# EAGLE design coringaM0 (EAGLE 7.5.0)
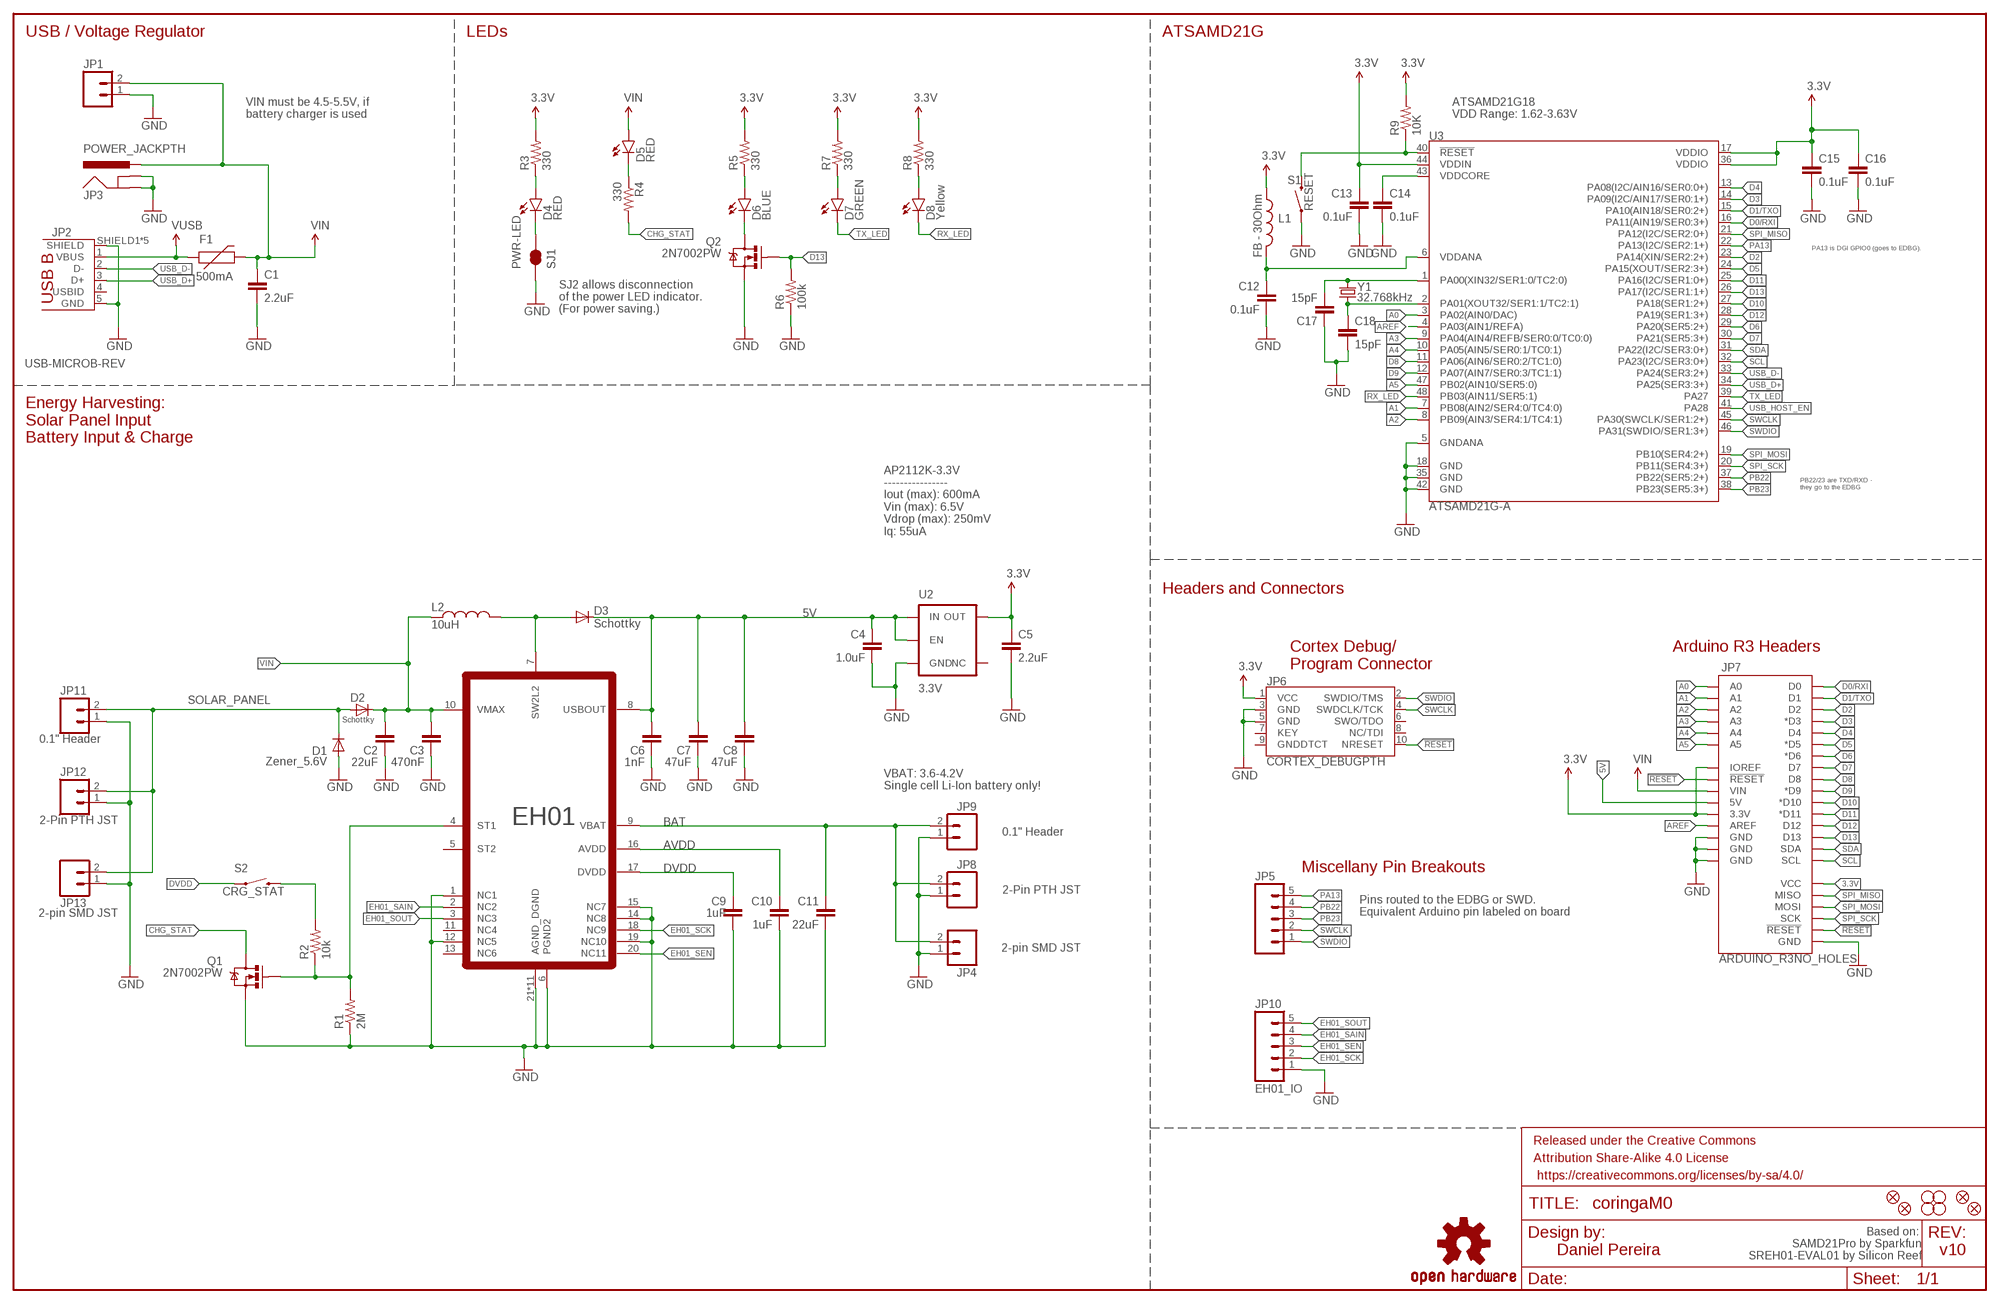
[diagram p0: schematic, sheet 1]

## Parts
C1  2.2uF  CAP1206  [1206]
C2  22uF  CAPC0805  [RCL_C0805]
C3  470nF  CAPC1206  [RCL_C1206]
C4  1.0uF  1.0UF-25V-+80/-20(0805)"  [0805-CAP]
C5  2.2uF  CAP1206  [1206]
C6  1nF  CAPC1206K  [RCL_C1206K]
C7  47uF  CAPC1206K  [RCL_C1206K]
C8  47uF  CAPC1206K  [RCL_C1206K]
C9  1uF  CAPC0402  [RCL_C0402]
C10  1uF  CAPC0402  [RCL_C0402]
C11  22uF  CAPC0805  [RCL_C0805]
C12  0.1uF  0.1UF-25V(+80/-20%)(0603)  [0603-CAP]
C13  0.1uF  0.1UF-25V(+80/-20%)(0603)  [0603-CAP]
C14  0.1uF  0.1UF-25V(+80/-20%)(0603)  [0603-CAP]
C15  0.1uF  0.1UF-25V(+80/-20%)(0603)  [0603-CAP]
C16  0.1uF  0.1UF-25V(+80/-20%)(0603)  [0603-CAP]
C17  15pF  15PF-50V-5%(0603)  [0603-CAP]
C18  15pF  15PF-50V-5%(0603)  [0603-CAP]
D1  Zener_5.6V  DIODE-DO-214AC  [DO-214AC]
D2  Schottky  DIODE-DO-214AC  [DO-214AC]
D3  Schottky  DIODE-DO-214AC  [DO-214AC]
D4  RED  LED-RED0603  [LED-0603]
D5  RED  LED-RED0603  [LED-0603]
D6  BLUE  LED-BLUE0603  [LED-0603]
D7  GREEN  LED-GREEN0603  [LED-0603]
D8  Yellow  LED-YELLOW0603  [LED-0603]
F1  500mA  PTCSMD  [PTC-1206]
FD1  FIDUCIAL-VIA  [FIDUCIAL-VIA]
FD2  FIDUCIAL-VIA  [FIDUCIAL-VIA]
FID1  FIDUCIAL1X2  [FIDUCIAL-1X2]
FID2  FIDUCIAL1X2  [FIDUCIAL-1X2]
FRAME1  FRAME-LEDGER  [CREATIVE_COMMONS]
JP1  M02PTH  [1X02]
JP2  USB-MICROB-REV  [USB-B-MICRO-REV-SMD]
JP3  POWER_JACKPTH  [POWER_JACK_PTH]
JP4  M02-JST-2MM-SMT  [JST-2-SMD]
JP5  M05NO_SILK  [1X05_NO_SILK]
JP6  CORTEX_DEBUGPTH  [2X5-PTH-1.27MM]
JP7  ARDUINO_R3NO_HOLES  [ARDUINO_R3_NO_HOLES]
JP8  M02-JST-2-PTH-NO_SILK  [JST-2-PTH-NS]
JP9  M021X02_NO_SILK  [1X02_NO_SILK]
JP10  EH01_IO  M05NO_SILK  [1X05_NO_SILK]
JP11  M021X02_NO_SILK  [1X02_NO_SILK]
JP12  M02-JST-2-PTH-NO_SILK  [JST-2-PTH-NS]
JP13  M02-JST-2MM-SMT  [JST-2-SMD]
L1  FB - 30Ohm  INDUCTOR0603  [0603]
L2  10uH  INDUCTOR-SRN4065  [SRN4065-100M]
LOGO3  OSHW-LOGOS  [OSHW-LOGO-S]
LOGO4  OSHW-LOGOL  [OSHW-LOGO-L]
Q1  2N7002PW  MOSFET-NCHANNEL2N7002PW  [SOT323]
Q2  2N7002PW  MOSFET-NCHANNEL2N7002PW  [SOT323]
R1  2M  RESR0402  [RESISTOR_R0402]
R2  10k  RESR0402  [RESISTOR_R0402]
R3  330  330OHM1/10W1%(0603)  [0603-RES]
R4  330  330OHM1/10W1%(0603)  [0603-RES]
R5  330  330OHM1/10W1%(0603)  [0603-RES]
R6  100k  100KOHM-1/10W-1%(0603)  [0603-RES]
R7  330  330OHM1/10W1%(0603)  [0603-RES]
R8  330  330OHM1/10W1%(0603)  [0603-RES]
R9  10K  10KOHM-1/10W-1%(0603)0603  [0603-RES]
S1  RESET  SWITCH-MOMENTARY-2SMD  [TACTILE-SWITCH-SMD]
S2  CRG_STAT  SWITCH-MOMENTARY-2SMD  [TACTILE-SWITCH-SMD]
SJ1  PWR-LED  JUMPER-PAD-2-NC_BY_TRACENO_SILK  [PAD-JUMPER-2-NC_BY_TRACE_NO_SILK]
STANDOFF1  STAND-OFF  [STAND-OFF]
STANDOFF2  STAND-OFF  [STAND-OFF]
STANDOFF3  STAND-OFF  [STAND-OFF]
STANDOFF4  STAND-OFF  [STAND-OFF]
U1  EH01  EH01-P02  [QFN20]
U2  3.3V  V_REG_AP2112K-3.3V  [SOT23-5]
U3  ATSAMD21G-A  [TQFP-48]
Y1  32.768kHz  CRYSTAL3.2X1.5MM  [CRYSTAL-SMD-3.2X1.5MM]

## Nets
3.3V: C5.1 C13.1 C15.1 C16.1 JP6.1(VCC) JP7.3.3V JP7.IOREF JP7.VCC L1.1 R3.2 R5.2 R7.2 R8.2 R9.2 U2.5(OUT) U3.17(VDDIO) U3.36(VDDIO) U3.44(VDDIN)
5V: C4.1 C6.2 C7.2 C8.2 D3.C JP7.5V U1.8(USBOUT) U2.1(IN) U2.3(EN)
!RESET: JP6.10(NRESET) JP7.RESET@1(!RESET!) JP7.RESET@2(!RESET!) R9.1 S1.3 U3.40(!RESET!)
A0: JP7.A0 U3.3(PA02(AIN0/DAC))
A1: JP7.A1 U3.7(PB08(AIN2/SER4:0/TC4:0))
A2: JP7.A2 U3.8(PB09(AIN3/SER4:1/TC4:1))
A3: JP7.A3 U3.9(PA04(AIN4/REFB/SER0:0/TC0:0))
A4: JP7.A4 U3.10(PA05(AIN5/SER0:1/TC0:1))
A5: JP7.A5 U3.47(PB02(AIN10/SER5:0))
AREF: JP7.AREF U3.4(PA03(AIN1/REFA))
AVDD: C10.2 U1.16(AVDD)
BAT: C11.2 JP4.2 JP8.2 JP9.2 U1.9(VBAT)
CHG_STAT: Q1.3(D) R4.2
D0/RXI: JP7.D0 U3.16(PA11(AIN19/SER0:3+))
D1/TXO: JP7.D1 U3.15(PA10(AIN18/SER0:2+))
D2: JP7.D2 U3.23(PA14(XIN/SER2:2+))
D3: JP7.D3(*D3) U3.14(PA09(I2C/AIN17/SER0:1+))
D4: JP7.D4 U3.13(PA08(I2C/AIN16/SER0:0+))
D5: JP7.D5(*D5) U3.24(PA15(XOUT/SER2:3+))
D6: JP7.D6(*D6) U3.29(PA20(SER5:2+))
D7: JP7.D7 U3.30(PA21(SER5:3+))
D8: JP7.D8 U3.11(PA06(AIN6/SER0:2/TC1:0))
D9: JP7.D9(*D9) U3.12(PA07(AIN7/SER0:3/TC1:1))
D10: JP7.D10(*D10) U3.27(PA18(SER1:2+))
D11: JP7.D11(*D11) U3.25(PA16(I2C/SER1:0+))
D12: JP7.D12 U3.28(PA19(SER1:3+))
D13: JP7.D13 Q2.1(G) R6.2 U3.26(PA17(I2C/SER1:1+))
DVDD: C9.2 S2.1 U1.17(DVDD)
EH01_SAIN: JP10.4 U1.2(NC2)
EH01_SCK: JP10.2 U1.18(NC9)
EH01_SEN: JP10.3 U1.20(NC11)
EH01_SOUT: JP10.5 U1.3(NC3)
EH01_ST1: Q1.1(G) R1.2 R2.1 U1.4(ST1)
EH01_SW: D3.A L2.P$2 U1.7(SW2L2)
GND: C1.2 C2.1 C3.1 C4.2 C5.2 C6.1 C7.1 C8.1 C9.1 C10.1 C11.1 C12.2 C13.2 C14.2 C15.2 C16.2 C17.1 C18.2 D1.A JP1.1 JP2.5(GND) JP2.SHIELD1(SHIELD) JP2.SHIELD2(SHIELD) JP2.SHIELD3(SHIELD) JP2.SHIELD4(SHIELD) JP2.SHIELD5(SHIELD) JP3.GND JP3.GNDBREAK JP4.1 JP6.3(GND) JP6.5(GND) JP7.GND@1(GND) JP7.GND@2(GND) JP7.GND@3(GND) JP7.GND@4(GND) JP8.1 JP9.1 JP10.1 JP11.1 JP12.1 JP13.1 Q1.2(S) Q2.2(S) R1.1 R6.1 S1.1 SJ1.1 U1.1(NC1) U1.6(PGND2) U1.12(NC5) U1.14(NC8) U1.15(NC7) U1.19(NC10) U1.21(AGND_DGND) U1.22(AGND_DGND) U1.P$1(AGND_DGND) U1.P$2(AGND_DGND) U1.P$3(AGND_DGND) U1.P$4(AGND_DGND) U1.P$5(AGND_DGND) U1.P$6(AGND_DGND) U1.P$7(AGND_DGND) U1.P$8(AGND_DGND) U1.P$9(AGND_DGND) U2.2(GND) U3.5(GNDANA) U3.18(GND) U3.35(GND) U3.42(GND)
N$2: C17.2 U3.1(PA00(XIN32/SER1:0/TC2:0)) Y1.P$2
N$3: D6.C Q2.3(D)
N$4: C18.1 U3.2(PA01(XOUT32/SER1:1/TC2:1)) Y1.P$1
N$5: D4.A R3.1
N$6: D6.A R5.1
N$8: D5.C R4.1
N$10: D7.A R7.1
N$11: D8.A R8.1
N$12: D4.C SJ1.2
N$14: R2.2 S2.3
PA13: JP5.5 U3.22(PA13(I2C/SER2:1+))
PB22: JP5.4 U3.37(PB22(SER5:2+))
PB23: JP5.3 U3.38(PB23(SER5:3+))
RX_LED: D8.C U3.48(PB03(AIN11/SER5:1))
SCL: JP7.SCL U3.32(PA23(I2C/SER3:0+))
SDA: JP7.SDA U3.31(PA22(I2C/SER3:0+))
SOLAR_PANEL: D1.C D2.A JP11.2 JP12.2 JP13.2
SPI_MISO: JP7.MISO U3.21(PA12(I2C/SER2:0+))
SPI_MOSI: JP7.MOSI U3.19(PB10(SER4:2+))
SPI_SCK: JP7.SCK U3.20(PB11(SER4:3+))
SWCLK: JP5.2 JP6.4(SWDCLK/TCK) U3.45(PA30(SWCLK/SER1:2+))
SWDIO: JP5.1 JP6.2(SWDIO/TMS) U3.46(PA31(SWDIO/SER1:3+))
TX_LED: D7.C U3.39(PA27)
USB_D+: JP2.3(D+) U3.34(PA25(SER3:3+))
USB_D-: JP2.2(D-) U3.33(PA24(SER3:2+))
USB_HOST_EN: U3.41(PA28)
VDDANA: C12.1 L1.2 U3.6(VDDANA)
VDDCORE: C14.1 U3.43(VDDCORE)
VIN: C1.1 C2.2 C3.2 D2.C D5.A F1.2 JP1.2 JP3.PWR JP7.VIN L2.P$1 U1.10(VMAX)
VUSB: F1.1 JP2.1(VBUS)
Unconnected: JP2.4(USBID) JP6.6(SWO/TDO) JP6.7(KEY) JP6.8(NC/TDI) JP6.9(GNDDTCT) U1.5(ST2) U1.11(NC4) U1.13(NC6) U2.4(NC)

## Notes on the sheet
- USB / Voltage Regulator | LEDs | ATSAMD21G
- VIN must be 4.5-5.5V, if 
  battery charger is used
- ATSAMD21G18
  VDD Range: 1.62-3.63V
- PA13 is DGI GPIO0 (goes to EDBG).
- SJ2 allows disconnection
  of the power LED indicator.
  (For power saving.)
- Energy Harvesting:
  Solar Panel Input
  Battery Input & Charge
- AP2112K-3.3V
  ----------------
  Iout (max): 600mA 
  Vin (max): 6.5V
  Vdrop (max): 250mV
  Iq: 55uA
- PB22/23 are TXD/RXD - 
  they go to the EDBG
- Headers and Connectors
- Cortex Debug/
  Program Connector
- Arduino R3 Headers
- 0.1" Header
- VBAT: 3.6-4.2V
  Single cell Li-Ion battery only\!
- 2-Pin PTH JST
- 0.1" Header
- Miscellany Pin Breakouts
- 2-Pin PTH JST
- Pins routed to the EDBG or SWD.
  Equivalent Arduino pin labeled on board
- 2-pin SMD JST
- 2-pin SMD JST
- Based on: 
  SAMD21Pro by Sparkfun
  SREH01-EVAL01 by Silicon Reef
- Daniel Pereira | v10

## Library data of the parts
C1 C5 = SparkFun-Passives:CAP: Capacitor Standard 0603 ceramic capacitor, and 0.1" leaded capacitor.
C2 C3 C6-C11 = Reference_design:CAP: CAPACITOR, European symbol
C4 = SparkFun-Capacitors:1.0UF-25V-+80/-20(0805): CAP-11625; PROD_ID: CAP-11625
C12-C16 = SparkFun-Capacitors:0.1UF-25V(+80/-20%)(0603): CAP-00810 Ceramic Standard decoupling cap; PROD_ID: CAP-00810
C17 C18 = SparkFun-Capacitors:15PF-50V-5%(0603): CAP-07881; PROD_ID: CAP-07881
D1-D3 = diode:DIODE-: DIODE
D4 D5 = SparkFun-LED:LED-RED: Assorted Red LEDs LilyPad 1206- DIO-09912 1206- DIO-00809 0603- DIO-00819 "SMART" means more efficient and expensive; PROD_ID: DIO-00819
D6 = SparkFun-LED:LED-BLUE: Blue LEDs for production use Various blue LEDs stocked by SparkFun production 0603 - DIO-08575 Rebel - DIO-09553 1206 - DIO-09911; PROD_ID: DIO-08575
D7 = SparkFun-LED:LED-GREEN: Various green LEDs Green LEDs used in SFE Production 0603- DIO-00821 LARGE- DIO-00862 LILYPAD- DIO-09910; PROD_ID: DIO-00821
D8 = SparkFun-LED:LED-YELLOW: Yellow SMD LEDs LilyPad 1206- DIO-09909 0603- DIO-09003 "SMART" means more efficient and expensive; PROD_ID: DIO-09003
F1 = SparkFun-PowerIC:PTC: Resettable Fuse PTC Resettable Fuse. Spark Fun Electronics SKU : COM-08357; PROD_ID: RES-11150
FD1 FD2 = SparkFun-Aesthetics:FIDUCIAL-VIA: Fiducial Alignment Points Various fiducial points for machine vision alignment.
FID1 FID2 = SparkFun-Aesthetics:FIDUCIAL: Fiducial Alignment Points Various fiducial points for machine vision alignment.
FRAME1 = SparkFun-Aesthetics:FRAME-LEDGER: Schematic Frame Standard 11x14 US Ledger frame
JP1 JP8 JP9 JP11 JP12 = SparkFun-Connectors:M02: Standard 2-pin 0.1" header. Use with - straight break away headers ( PRT-00116) - right angle break away headers (PRT-00553) - swiss pins (PRT-00743) - machine pins (PRT-00117) - female headers (PRT-00115) Molex polarized connector foot print use with: PRT-08233 with associated crimp pins and housings. 2.54_SCREWTERM for use with PRT-10571. 3.5mm Screw Terminal footprints for PRT-08084 5mm Screw Terminal footprints for use with PRT-08432
JP2 = coringaM0-Lib:USB-MICROB-REV; MPN: ZX62R-B-5P
JP3 = SparkFun-Connectors:POWER_JACK: Power Jack This is the standard 5.5mm barrel jack for power. The PTH is the most common, proven, reliable, footprint. The Slot footprint only works if the mill layer is transmitted to the PCB fab house so be warned. Mating wall wart : TOL-00298 (and others); PROD_ID: CONN-08197
JP4 JP13 = SparkFun-Connectors:M02: Standard 2-pin 0.1" header. Use with - straight break away headers ( PRT-00116) - right angle break away headers (PRT-00553) - swiss pins (PRT-00743) - machine pins (PRT-00117) - female headers (PRT-00115) Molex polarized connector foot print use with: PRT-08233 with associated crimp pins and housings. 2.54_SCREWTERM for use with PRT-10571. 3.5mm Screw Terminal footprints for PRT-08084 5mm Screw Terminal footprints for use with PRT-08432; PROD_ID: CONN-11443
JP5 JP10 = SparkFun-Connectors:M05: Header 5 Standard 5-pin 0.1" header. Use with straight break away headers (SKU : PRT-00116), right angle break away headers (PRT-00553), swiss pins (PRT-00743), machine pins (PRT-00117), and female headers (PRT-00115). Molex polarized connector foot print use with SKU : PRT-08230 with associated crimp pins and housings.
JP6 = samd21-temp:CORTEX_DEBUG: Cortex Debug Connector Datasheet <http://infocenter.arm.com/help/topic/com.arm.doc.faqs/attached/13634/cortex_debug_connectors.pdf>
JP7 = SparkFun-Boards:ARDUINO_R3: Arduino R3 Footprint (w/ SPI header)
L1 = SparkFun-Passives:INDUCTOR: Inductors Basic Inductor/Choke - 0603 and 1206. Footprints are not proven and vary greatly between part numbers. INDUCTOR POWER 3.3UH 4.0A SMD 0.197" L x 0.197" W x 0.177" H (5.00mm x 5.00mm x 4.50mm); PROD_ID: RES-07859
L2 = siliconreef:INDUCTOR
LOGO3 LOGO4 = SparkFun-Aesthetics:OSHW-LOGO: Open Source Hardware Logo This logo indicates the piece of hardware it is found on incorporates a OSHW license and/or adheres to the definition of open source hardware found here: http://freedomdefined.org/OSHW
Q1 Q2 = SparkFun-DiscreteSemi:MOSFET-NCHANNEL: Common NMOSFET Parts MFG P/N Store ID Prod ID FDD8780 TRANS-09984 SI7820DN TRANS-11055 FDS6630A IC-08089 2N7002PW TRANS-11151 FQP30N06L COM-10213 TRANS-10060 BSS123LT1G TRANS-08345 BSS138 TRANS-00830 BS170 2N7000; PROD_ID: TRANS-11151
R1 R2 = Reference_design:RES: RESISTOR, American symbol
R3-R5 R7 R8 = SparkFun-Resistors:330OHM1/10W1%(0603): RES-00818; PROD_ID: RES-00818
R6 = SparkFun-Resistors:100KOHM-1/10W-1%(0603): RES-07828; PROD_ID: RES-07828
R9 = SparkFun-Resistors:10KOHM-1/10W-1%(0603): RES-00824; PROD_ID: RES-00824
S1 S2 = SparkFun-Electromechanical:SWITCH-MOMENTARY-2: Various NO switches- pushbuttons, reed, etc; PROD_ID: SWCH-08247
SJ1 = SparkFun-Passives:JUMPER-PAD-2-NC_BY_TRACE
STANDOFF1-STANDOFF4 = SparkFun-Electromechanical:STAND-OFF: #4 Stand Off This is the mechanical footprint for a #4 phillips button head screw. Use the keepout ring to avoid running the screw head into surrounding components. SKU : PRT-00447
U1 = reference-design:EH01: EH01 uses 0.18um CMOS technology and is available at PQFN20 package (5mm x 5mm), compatible with MO-220 VHHC-2 JEDEC standard.
U2 = SparkFun-PowerIC:V_REG_AP2112: AP2112 - 600mA CMOS LDO Regulator w/ Enable The AP2112 is CMOS process low dropout linear regulator with enable function, the regulator delivers a guaranteed 600mA (min.) continuous load current. Features Output Voltage Accuracy: ±1.5% Output Current: 600mA (Min.) Foldback Short Current Protection: 50mA Enable Function to Turn ON/OFF VOUT Low Dropout Voltage (3.3V): 250mV (Typ.) @IOUT=600mA Excellent Load Regulation: 0.2%/A (Typ.) Excellent Line Regulation: 0.02%/V (Typ.) Low Quiescent Current: 55μA (Typ.) Low Standby Current: 0.01μA (Typ.) Low Output Noise: 50μVRMS PSRR: 100Hz -65dB, 1kHz -65dB OTSD Protection Stable with 1.0μF Flexible Cap: Ceramic, Tantalum and Aluminum Electrolytic Operation Temperature Range: -40°C to 85°C ESD: MM 400V, HBM 4000V; PROD_ID: VREG-12457
U3 = samd21-temp:ATSAMD21G: Atmel SAMD21G SMART ARM-Based Microcontroller The Atmel ® | SMART ™ SAM D21 is a series of low-power microcontrollers using the 32-bit ARM ® Cortex ® -M0+ processor, and ranging from 32- to 64-pins with up to 256KB Flash and 32KB of SRAM. The SAM D21 devices operate at a maximum frequency of 48MHz and reach 2.46 CoreMark/MHz. They are designed for simple and intuitive migration with identical peripheral modules, hex compatible code, identical linear address map and pin compatible migration paths between all devices in the product series. All devices include intelligent and flexible peripherals, Atmel Event System for inter-peripheral signaling, and support for capacitive touch button, slider and wheel user interfaces.; PROD_ID: IC-13064
Y1 = samd21-temp:CRYSTAL: Various standard crystals. Proven footprints.; PROD_ID: XTAL-13062

## Board
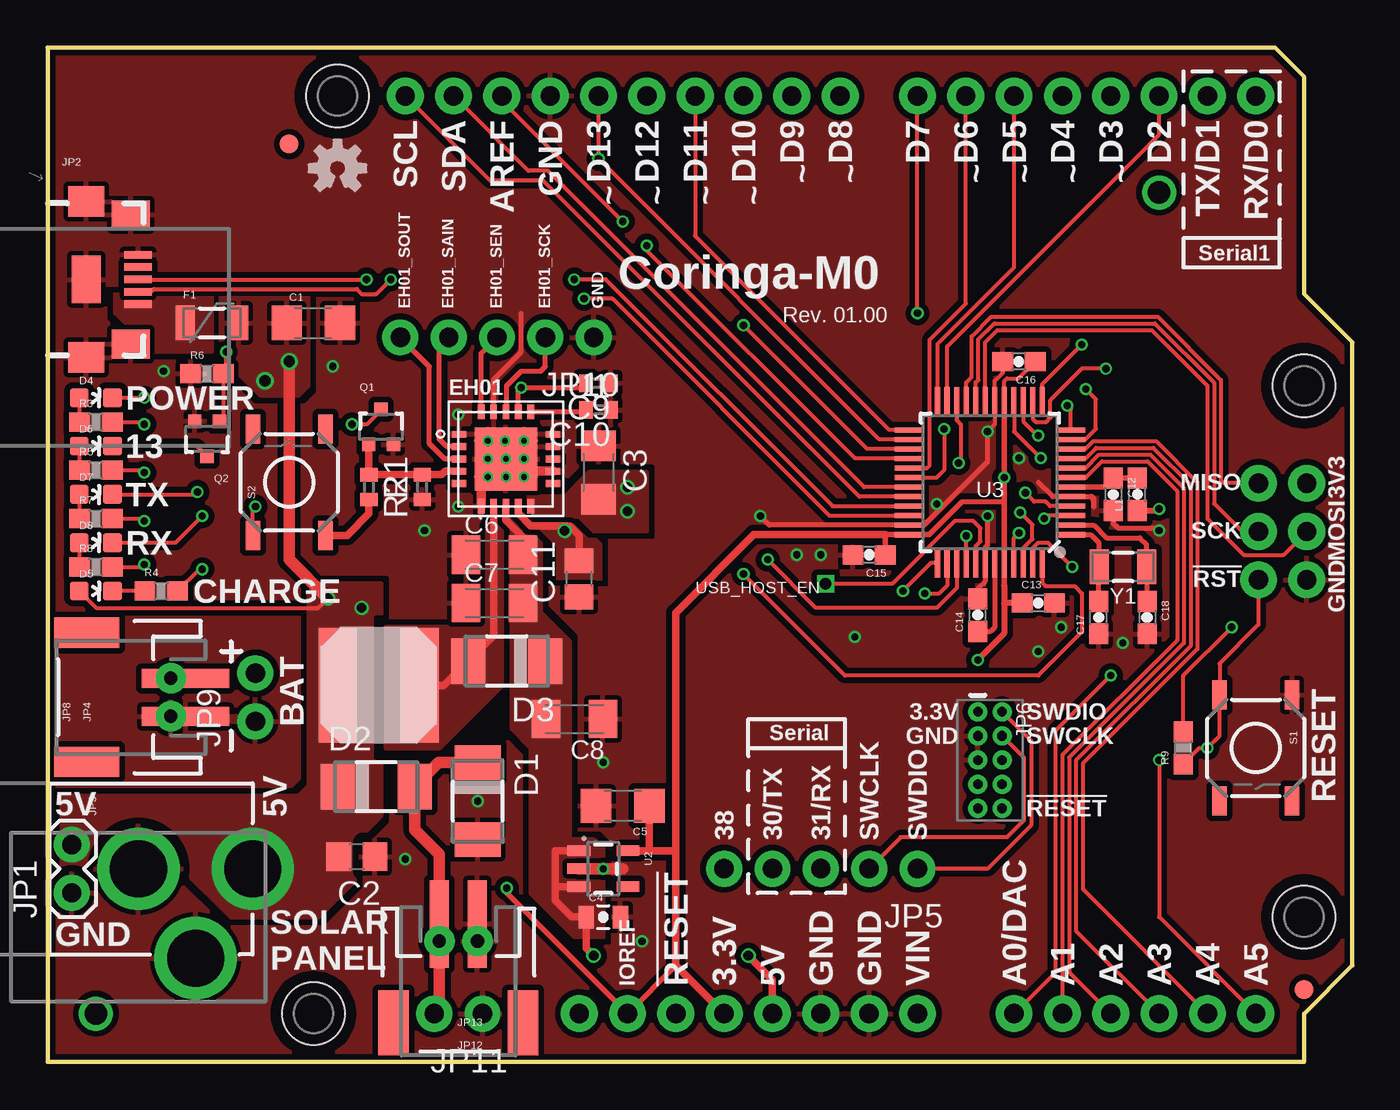
[diagram p1: board, top side]
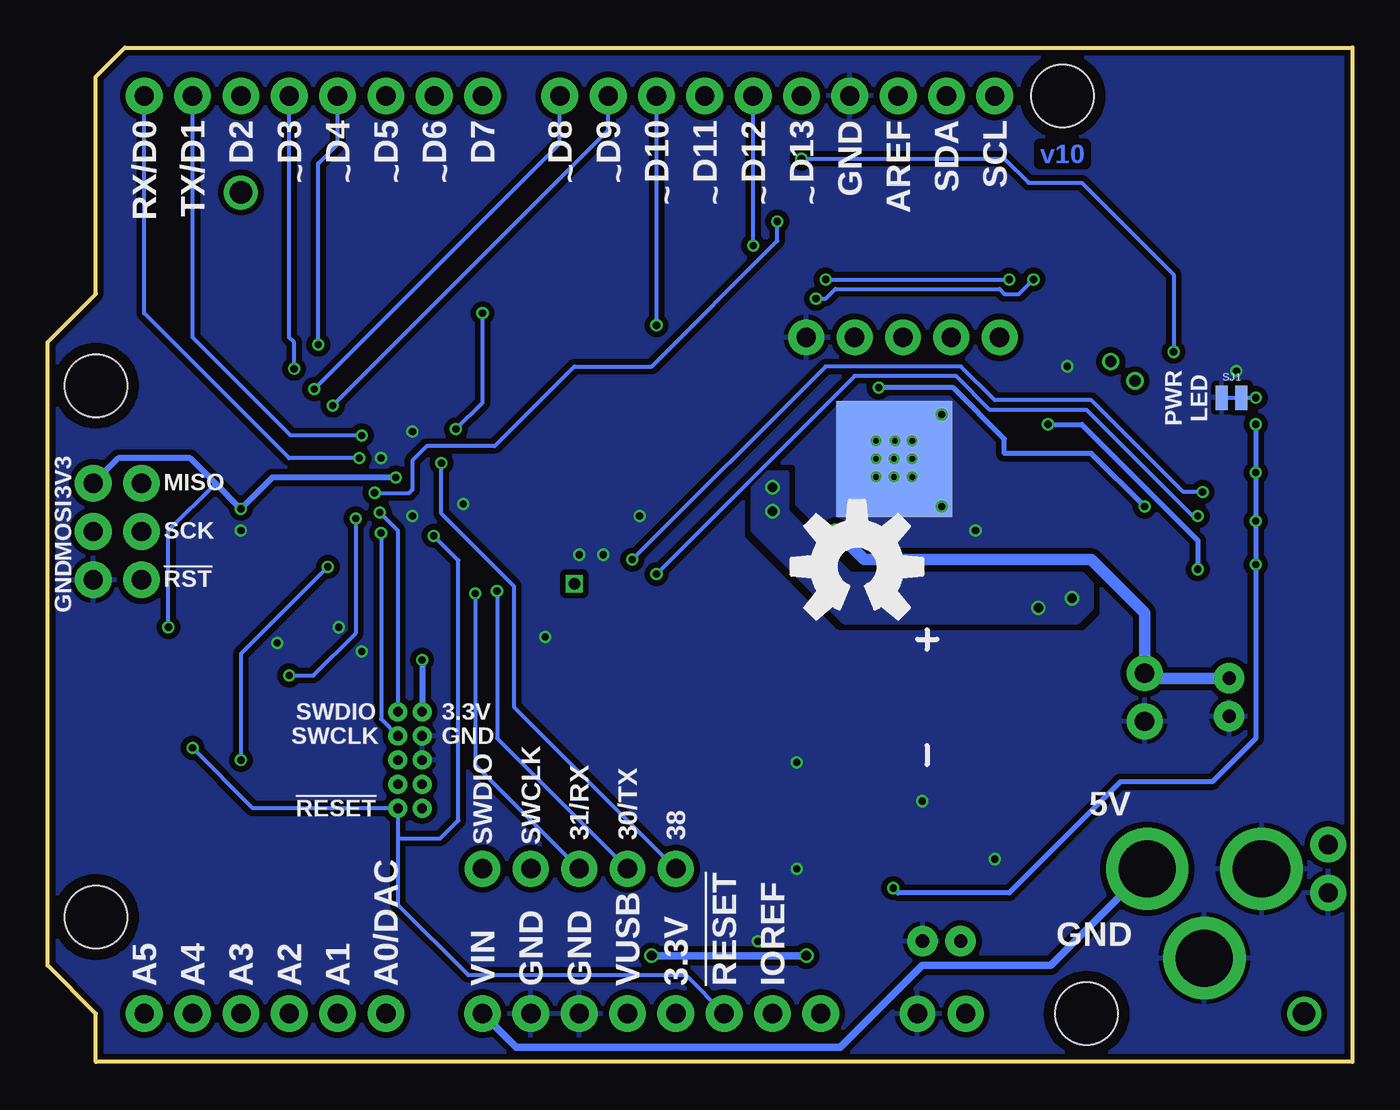
[diagram p2: board, bottom side, seen from below]

Size 68.58 x 53.34 mm. Coordinates in mm from the lower left corner, seen from the top.
Outline: 0,53.34 0,0 66.04,0 66.04,2.54 68.58,5.08 68.58,37.85 66.04,40.39 66.04,51.82 64.52,53.34 0,53.34
Copper layers (1*16): Top 0.035mm / dielectric 1.5mm / Bottom 0.035mm
Design rules "Gold_Phoenix_Standard_Spec_2_layer": minimum track width 5mil, minimum drill 6mil, track to track 5mil, track to pad 5mil, pad to pad 5mil, via to via 5mil, smd to smd 5mil, copper to edge 8mil, drill to drill 8mil, minimum pad ring 5mil, minimum via ring 5mil, stop-mask expansion 4mil, vias tented up to drill 20mil, thermal gap 10mil

### Footprints (pad centres in the part's own frame; a part is rotated, then mirrored left to right if it is on the bottom)
1206 = smd 1.6 x 1.8: 1 -1.4,0; 2 1.4,0
RCL_C0805 = smd 1.3 x 1.5: 1 -0.95,0; 2 0.95,0
RCL_C1206 = smd 1.6 x 1.8: 1 -1.4,0; 2 1.4,0
0805-CAP = smd 0.8 x 1.2: 1 -0.9,0; 2 0.9,0
RCL_C1206K = smd 1.5 x 2: 1 -1.5,0; 2 1.5,0
RCL_C0402 = smd 0.7 x 0.9: 1 -0.65,0; 2 0.65,0
0603-CAP = smd 1.1 x 1: 1 -0.85,0; 2 0.85,0
DO-214AC = smd 1.8 x 2.4: A 2.025,0; C -2.025,0
LED-0603 = smd 1 x 1: A 0,-0.877; C 0,0.877
PTC-1206 = smd 1 x 1.8: 1 -1.4,0; 2 1.4,0
FIDUCIAL-VIA = drill 1.194: P$1 0,0
FIDUCIAL-1X2 = smd 1 x 1: 1 0,0
1X02 = drill 1.016 pad 1.88: 1 0,0; 2 2.54,0
USB-B-MICRO-REV-SMD = smd 1.45 x 0.4: 1 2.725,-1.3; 2 2.725,-0.65; 3 2.725,0; 4 2.725,0.65; 5 2.725,1.3 | smd 1.5 x 2.5: SHIELD1 0,0 | smd 1.9 x 1.6: SHIELD2 0,-4.1; SHIELD3 0,4.1 | smd 2 x 1.5: SHIELD4 2.35,-3.4; SHIELD5 2.35,3.4
POWER_JACK_PTH = drill 2.997 pad 4.318: GND 0,7.7; GNDBREAK 4.7,10.7; PWR 0,13.7
JST-2-SMD = smd 1 x 4.6: 1 -1,-3.7; 2 1,-3.7 | smd 1.6 x 3.4: NC1 -3.4,1.5; NC2 3.4,1.5
1X05_NO_SILK = drill 1.016 pad 1.88: 1 0,0; 2 2.54,0; 3 5.08,0; 4 7.62,0; 5 10.16,0
2X5-PTH-1.27MM = drill 0.508 pad 1: 1 -2.54,-0.635; 2 -2.54,0.635; 3 -1.27,-0.635; 4 -1.27,0.635; 5 0,-0.635; 6 0,0.635; 7 1.27,-0.635; 8 1.27,0.635; 9 2.54,-0.635; 10 2.54,0.635
ARDUINO_R3_NO_HOLES = drill 1.016 pad 1.93: 3.3V 35.56,2.54; 5V 38.1,2.54; A0 50.8,2.54; A1 53.34,2.54; A2 55.88,2.54; A3 58.42,2.54; A4 60.96,2.54; A5 63.5,2.54; AREF 23.876,50.8; D0 63.5,50.8; D1 60.96,50.8; D2 58.42,50.8; D3 55.88,50.8; D4 53.34,50.8; D5 50.8,50.8; D6 48.26,50.8; D7 45.72,50.8; D8 41.656,50.8; D9 39.116,50.8; D10 36.576,50.8; D11 34.036,50.8; D12 31.496,50.8; D13 28.956,50.8; GND@1 40.64,2.54; GND@2 43.18,2.54; GND@3 26.416,50.8; GND@4 66.18,25.35; IOREF 30.48,2.54; MISO 63.64,30.43; MOSI 66.18,27.89; NC 27.94,2.54; RESET@1 33.02,2.54; RESET@2 63.64,25.35; SCK 63.64,27.89; SCL 18.796,50.8; SDA 21.336,50.8; VCC 66.18,30.43; VIN 45.72,2.54
JST-2-PTH-NS = drill 0.7 pad 1.6: 1 -1,0; 2 1,0
1X02_NO_SILK = drill 1.016 pad 1.88: 1 0,0; 2 2.54,0
0603 = smd 1.1 x 1: 1 -0.85,0; 2 0.85,0
SRN4065-100M = smd 2 x 6: P$1 -2.15,0; P$2 2.15,0
SOT323 = smd 0.7 x 0.7: 1 -0.65,-0.925; 2 0.65,-0.925; 3 0,0.925
RESISTOR_R0402 = smd 0.7 x 0.9: 1 -0.65,0; 2 0.65,0
0603-RES = smd 1.1 x 1: 1 -0.85,0; 2 0.85,0
TACTILE-SWITCH-SMD = smd 1.524 x 0.762: 1 -2.794,1.905; 2 2.794,1.905; 3 -2.794,-1.905; 4 2.794,-1.905
PAD-JUMPER-2-NC_BY_TRACE_NO_SILK = smd 0.635 x 1.27: 1 -0.508,0; 2 0.508,0
STAND-OFF = hole 3.302: 0,0
QFN20 = smd 0.762 x 0.356: 1 0.022,3.8; 2 0.022,3.15; 3 0.022,2.5; 4 0.022,1.85; 5 0.022,1.2; 11 4.978,1.2; 12 4.978,1.85; 13 4.978,2.5; 14 4.978,3.15; 15 4.978,3.8 | smd 0.356 x 0.762: 6 1.2,0.022; 7 1.85,0.022; 8 2.5,0.022; 9 3.15,0.022; 10 3.8,0.022; 16 3.8,4.978; 17 3.15,4.978; 18 2.5,4.978; 19 1.85,4.978; 20 1.2,4.978 | smd 3.3 x 3.3: 21 2.5,2.5 | smd 6.096 x 6.096 bottom: 22 2.5,2.5 | drill 0.3: P$1 1.55,3.45; P$2 3.45,3.45; P$3 1.55,1.55; P$4 3.45,1.55; P$5 2.5,2.5; P$6 1.55,2.5; P$7 3.45,2.5; P$8 2.45,3.45; P$9 2.5,1.55
SOT23-5 = smd 0.55 x 1.2: 1 -0.95,-1.3; 2 0,-1.3; 3 0.95,-1.3; 4 0.95,1.3; 5 -0.95,1.3
TQFP-48 = smd 1.5 x 0.28: 1 -4.25,2.75; 2 -4.25,2.25; 3 -4.25,1.75; 4 -4.25,1.25; 5 -4.25,0.75; 6 -4.25,0.25; 7 -4.25,-0.25; 8 -4.25,-0.75; 9 -4.25,-1.25; 10 -4.25,-1.75; 11 -4.25,-2.25; 12 -4.25,-2.75; 25 4.25,-2.75; 26 4.25,-2.25; 27 4.25,-1.75; 28 4.25,-1.25; 29 4.25,-0.75; 30 4.25,-0.25; 31 4.25,0.25; 32 4.25,0.75; 33 4.25,1.25; 34 4.25,1.75; 35 4.25,2.25; 36 4.25,2.75 | smd 0.28 x 1.5: 13 -2.75,-4.25; 14 -2.25,-4.25; 15 -1.75,-4.25; 16 -1.25,-4.25; 17 -0.75,-4.25; 18 -0.25,-4.25; 19 0.25,-4.25; 20 0.75,-4.25; 21 1.25,-4.25; 22 1.75,-4.25; 23 2.25,-4.25; 24 2.75,-4.25; 37 2.75,4.25; 38 2.25,4.25; 39 1.75,4.25; 40 1.25,4.25; 41 0.75,4.25; 42 0.25,4.25; 43 -0.25,4.25; 44 -0.75,4.25; 45 -1.25,4.25; 46 -1.75,4.25; 47 -2.25,4.25; 48 -2.75,4.25
CRYSTAL-SMD-3.2X1.5MM = smd 1 x 1.8: P$1 -1.25,0; P$2 1.25,0

### Placement (x,y rotation side)
C1  13.97,38.86 0 top
C2  16.26,10.79 180 top
C3  28.96,30.99 270 top
C4  29.21,7.62 0 top
C5  30.23,13.46 180 top
C6  23.5,26.67 0 top
C7  23.5,24.13 0 top
C8  27.69,18.03 180 top
C9  28.96,35.69 180 top
C10  28.96,34.29 180 top
C11  27.94,25.4 90 top
C12  56.01,29.84 270 top
C13  52.07,24.13 0 top
C14  48.9,23.5 90 top
C15  43.18,26.67 180 top
C16  51.05,36.83 180 top
C17  55.24,23.37 90 top
C18  57.78,23.37 270 top
D1  22.61,13.72 270 top
D2  17.27,14.48 0 top
D3  24.13,21.08 180 top
D4  2.54,34.92 270 top
D5  2.54,24.77 270 top
D6  2.54,32.38 270 top
D7  2.54,29.84 270 top
D8  2.54,27.3 270 top
F1  8.64,38.86 0 top
FD1  2.54,2.54 0 top
FD2  58.42,45.72 0 top
FID1  12.7,48.26 0 top
FID2  66.04,3.81 0 top
FRAME1  0,0 0 top
JP1  1.27,8.89 90 top
JP2  2.03,41.15 0 top
JP3  -2.92,10.16 270 top
JP4  3.56,19.18 90 top
JP5  45.72,10.16 180 top
JP6  49.53,15.88 270 top
JP7  0,0 0 top
JP8  6.48,19.18 90 top
JP9  10.92,17.91 90 top
JP10  28.7,38.1 180 top
JP11  22.86,2.54 180 top
JP12  21.59,6.35 180 top
JP13  21.59,3.56 180 top
L1  57.28,29.84 90 top
L2  17.4,19.81 0 top
LOGO3  15.24,46.99 0 top
LOGO4  26.04,26.04 0 bottom
Q1  17.53,33.4 0 top
Q2  8.38,32.77 180 top
R1  19.68,30.23 90 top
R2  16.89,30.23 270 top
R3  2.54,33.66 0 top
R4  5.97,24.77 0 top
R5  2.54,31.11 0 top
R6  8.38,36.2 0 top
R7  2.54,28.57 0 top
R8  2.54,26.04 0 top
R9  59.69,16.51 90 top
S1  63.5,16.51 270 top
S2  12.7,30.48 90 top
SJ1  6.35,34.92 0 bottom
STANDOFF1  66.04,7.62 0 top
STANDOFF2  15.24,50.8 0 top
STANDOFF3  13.97,2.54 0 top
STANDOFF4  66.04,35.56 0 top
U1  21.59,29.21 0 top
U2  29.21,10.16 270 top
U3  49.53,30.48 180 top
Y1  56.52,26.04 180 top

### Tracks (layer width: path | path; a pad name or v marks a point on that pad's centre or on a via)
3.3V  (via drill 0.38)
  Top 0.203: U3.17 50.28,35.8 50.42,35.94 51.02,35.94 C16.1 | R9.2 59.69,20.32 v62.23,22.86 | R8.2 4.95,26.04 v5.08,26.16 | R7.2 4.95,28.57 v5.08,28.45 | R3.2 4.95,33.66 v5.08,33.53 | R5.2 4.95,31.11 v5.08,30.99
  Top 0.254: 46.34,27.73 48.07,29.46 50.28,29.46 | 33.02,5.08 JP7.IOREF 24.13,8.89 v24.13,9.14
  Top 0.279: U3.17 v50.28,30.73 50.28,29.46 U3.44 50.28,25.07 | 46.34,27.73 U3.36 44.03,27.73 C15.1
  Top 0.305: L1.1 58.33,29 v58.42,29.08 | 50.28,25.07 50.28,24.13 | 50.28,24.13 50.28,22.53 v48.9,21.14 | C13.1 50.28,24.13
  Top 0.406: 44.03,27.73 37.13,27.73 33.02,23.62 33.02,11.11 | 33.02,11.11 U2.5 31.63,11.11 C5.1 | JP7.3.3V 33.02,5.08 33.02,11.11
  Bottom 0.203: v62.23,22.86 62.23,27.94 59.75,30.42
  Bottom 0.254: v5.08,33.53 v5.08,30.99 v5.08,28.45 v5.08,26.16 5.08,17.02 7.37,14.73 12.19,14.73 18.03,8.89 23.88,8.89 v24.13,9.14
  Bottom 0.305: v50.28,30.73 56.77,30.73 v58.42,29.08 59.75,30.42 61.09,31.75 64.86,31.75 JP7.VCC | v48.9,21.14 JP6.1
5V  (via drill 0.51)
  Top 0.406: 26.67,9.21 26.67,8.51 27.56,7.62 C4.1 28.31,5.98 v28.7,5.59 | 26.67,9.21 26.67,11.11 U2.1 | U2.3 26.67,9.21 | U1.8 24.09,28.49 25,27.58 C6.2 | v36.83,5.59 38.1,4.32 JP7.5V
  Bottom 0.406: v28.7,5.59 v36.83,5.59
  pour Top (isolate 0.254, rank 3, no thermals): 23.88,28.7 24.38,28.19 24.38,27.43 24.38,18.29 24.38,17.53 25.4,16.51 25.4,8.89 27.69,6.6 29.21,6.6 29.21,11.18 28.7,11.68 27.43,11.68 27.43,22.1 25.91,23.62 25.91,27.43 25.65,27.69 25.15,27.69 24.38,28.45 24.18,28.65 24.18,28.7
!RESET  (via drill 0.38)
  Top 0.203: U3.40 v48.28,27.67 | R9.1 60.54,16.51 v60.96,16.51 61.59,17.14 S1.3 61.59,20.95 63.64,23 JP7.RESET@2
  Bottom 0.203: 50.16,11.75 47.94,11.75 46.99,12.7 46.99,26.38 v48.28,27.67 | v60.96,16.51 57.78,13.34 JP6.10 50.16,11.75 | 50.16,11.75 50.16,8.26 46.48,4.57 35.05,4.57 JP7.RESET@1
A0  (via drill 0.38)
  Top 0.203: U3.3 52.54,28.73 v52.39,28.57 | v55.88,20.32 52.96,17.4 52.96,4.7 JP7.A0
  Bottom 0.203: v52.39,28.57 52.39,22.54 54.61,20.32 v55.88,20.32
A1
  Top 0.203: JP7.A1 53.34,16.15 59.36,22.17 59.36,30.02 57.81,31.57 55.41,31.57 54.57,30.73 U3.7
A2
  Top 0.203: JP7.A2 53.7,4.72 53.7,16 59.72,22.02 59.72,30.18 57.96,31.93 55.26,31.93 54.56,31.23 U3.8
A3
  Top 0.203: JP7.A3 54.05,6.91 54.05,15.85 60.07,21.87 60.07,30.33 58.12,32.28 55.1,32.28 54.55,31.73 U3.9
A4
  Top 0.203: U3.10 54.54,32.23 54.95,32.64 58.27,32.64 60.43,30.48 60.43,21.72 54.41,15.7 54.41,9.09 JP7.A4
A5  (via drill 0.38)
  Top 0.203: U3.47 51.78,27.02 52.07,27.3 52.58,27.3 v53.85,26.04 | v58.42,15.88 58.42,7.62 JP7.A5
  Bottom 0.203: v53.85,26.04 58.42,21.46 v58.42,15.88
AREF  (via drill 0.38)
  Top 0.203: U3.4 52.69,29.23 52.45,29.46 51.86,29.46 v51.39,29.93 | JP7.AREF 23.88,50.55 v30.23,44.2
  Bottom 0.203: v51.39,29.93 49.57,29.93 49.4,30.1 49.4,31.62 48.64,32.38 45.09,32.38 40.89,36.58 36.83,36.58 30.23,43.18 v30.23,44.2
AVDD
  Top 0.254: U1.16 28.2,34.19 C10.2
BAT  (via drill 0.5)
  Top 0.203: JP8.2 JP4.2
  Top 0.406: U1.9 24.74,28.85 25.4,28.19 27.43,28.19 27.94,27.69 C11.2
  Bottom 0.61: JP8.2 10.65,20.18 JP9.2 10.92,23.62 13.72,26.42 25.65,26.42 v27.18,27.94
  pour Top (isolate 0.254, rank 2, no thermals): 26.92,25.4 28.96,25.4 28.96,27.18 27.69,28.45 25.15,28.45 25.4,28.19 25.91,28.19 26.92,27.18
CHG_STAT  (via drill 0.38)
  Top 0.203: v16,33.53 16.76,33.53 17.53,34.29 Q1.3 | R4.2 7.96,25.91 v8.13,25.91
  Bottom 0.254: v16,33.53 14.22,33.53 8.13,27.43 v8.13,25.91
D0/RXI  (via drill 0.38)
  Top 0.203: U3.16 50.8,34.71 50.8,33.15 v52.2,31.75
  Bottom 0.203: JP7.D0 63.5,39.37 55.88,31.75 v52.2,31.75
D1/TXO  (via drill 0.38)
  Top 0.203: U3.15 51.28,33.68 52.02,32.94 v52.07,32.94
  Bottom 0.203: JP7.D1 60.96,38.1 55.8,32.94 v52.07,32.94
D2
  Top 0.203: U3.23 47.28,37.63 58.42,48.77 JP7.D2
D3  (via drill 0.38)
  Top 0.203: U3.14 51.78,33.82 51.94,33.66 52.48,33.66 52.7,33.88 52.7,34.8 54.36,36.45 v55.63,36.45
  Bottom 0.203: v55.63,36.45 55.63,37.85 55.88,38.1 JP7.D3
D4  (via drill 0.38)
  Top 0.203: U3.13 52.28,35.64 v54.36,37.72
  Bottom 0.203: v54.36,37.72 54.36,47.24 53.34,48.26 JP7.D4
D5
  Top 0.203: JP7.D5 50.8,41.78 46.78,37.76 U3.24
D6
  Top 0.203: U3.29 46.22,31.23 46.35,31.37 46.35,37.97 48.26,39.88 JP7.D6
D7  (via drill 0.38)
  Top 0.203: U3.30 46.73,30.73 47.12,31.11 v47.12,33.27 | v45.72,39.37 JP7.D7
  Bottom 0.203: v47.12,33.27 45.72,34.67 v45.72,39.37
D8  (via drill 0.38)
  Top 0.203: U3.11 54.54,32.73 55.09,33.29 55.09,34.85 v54.56,35.38
  Bottom 0.203: v54.56,35.38 41.66,48.28 JP7.D8
D9  (via drill 0.38)
  Top 0.203: U3.12 53.78,34.33 v53.59,34.52
  Bottom 0.203: v53.59,34.52 39.12,49 JP7.D9
D10  (via drill 0.38)
  Top 0.203: U3.27 43.08,32.23 v36.58,38.73
  Bottom 0.203: v36.58,38.73 JP7.D10
D11
  Top 0.203: U3.25 44.24,33.23 34.04,43.43 JP7.D11
D12  (via drill 0.38)
  Top 0.203: U3.28 42.44,31.73 31.5,42.67 v31.5,42.93
  Bottom 0.203: v31.5,42.93 JP7.D12
D13  (via drill 0.38)
  Top 0.203: U3.26 43.72,32.73 v28.96,47.5 JP7.D13 | Q2.1 9.23,33.89 R6.2 9.4,36.36 v9.4,37.34
  Bottom 0.203: v28.96,47.5 18.29,47.5 17.02,46.23 14.22,46.23 9.4,41.4 v9.4,37.34
DVDD  (via drill 0.38)
  Top 0.203: S2.1 10.79,29.08 v10.92,29.21
  Top 0.254: 28.31,35.67 C9.2 28.08,35.46 v24.89,35.46 24.74,35.31 U1.17
  Bottom 0.254: v10.92,29.21 13.72,32 18.29,32 18.29,32.77 20.98,35.46 v24.89,35.46
EH01_SAIN
  Top 0.254: U1.2 20.98,32.36 20.57,32.77 20.57,37.59 JP10.4
EH01_SCK
  Top 0.254: U1.18 24.13,34.23 24.13,35.56 24.89,36.32 25.91,36.32 26.16,36.58 JP10.2
EH01_SEN
  Top 0.254: U1.20 22.79,37.27 JP10.3
EH01_SOUT
  Top 0.254: U1.3 20.87,31.71 20.07,32.51 20.07,36.58 JP10.5
EH01_ST1
  Top 0.406: U1.4 20.9,31.06 20.72,30.88 R1.2 R2.1 16.88,30.89 Q1.1
EH01_SW
  Top 0.406: U1.7 23.44,22.42 D3.A 20.84,19.81 L2.P$2
  pour Top (isolate 0.254, no thermals): 23.11,27.94 23.11,23.11 22.86,22.86 17.78,22.86 17.78,16.51 20.57,16.51 23.88,19.81 23.88,28.19 23.57,28.45 23.37,28.45
GND  (via drill 0.38)
  Top 0.203: C16.2 50.2,36.23 49.78,35.81 U3.18 49.78,33.52 v49.4,33.15
  Top 0.254: 56.26,28.07 58.29,28.07 v58.42,27.94 | v49.4,33.15 49.4,31.56 46.07,28.23 U3.35 37.94,28.23 v37.47,28.7 | v49.4,28.7 49.4,27.18 49.28,27.05 U3.42 49.28,25.28 48.9,24.89 C14.2 | 54.85,29.73 U3.5 52.82,29.73 52.07,30.48 | U1.19 23.44,35.89 24.89,37.34 24.89,39.37
  Top 0.279: 54.85,29.73 54.99,29.59 54.99,29.21 | C12.2 56.01,28.32 56.26,28.07
  Top 0.508: U1.6 22.79,30.41 23.11,30.73 | U1.12 25.34,31.06 U1.P$4
  Top 0.61: U2.2 v29.21,10.16 30.23,10.16
  other vias: 53.28,22.86 56.52,22.03 46.74,29.34 51.05,31.75 40.64,26.67 39.37,26.67 42.42,22.35 52.07,21.59 31.24,6.35 18.8,10.67 22.61,13.72 29.21,15.75 21.59,34.04 21.59,29.21 6.1,36.32 19.81,27.94 14.99,36.58
  pour Top (isolate 0.305, rank 6): 0,53.34 0,0 68.58,0 68.58,53.34
  pour Bottom (isolate 0.305, rank 6): 0,53.34 0,0 68.58,0 68.58,53.34
N$2
  Top 0.254: C17.2 55.24,26.02 Y1.P$2 55.27,27.29 54.82,27.73 U3.1
N$3
  Top 0.203: Q2.3 7.84,32.38 D6.C
N$4
  Top 0.254: C18.1 57.78,26.02 Y1.P$1 57.77,27.2 57.4,27.56 55.65,27.56 54.98,28.23 U3.2
N$5
  Top 0.203: D4.A 1.66,33.68 R3.1
N$6
  Top 0.203: R5.1 1.69,32.36 D6.A
N$8
  Top 0.203: R4.1 D5.C
N$10
  Top 0.203: R7.1 1.69,29.82 D7.A
N$11
  Top 0.203: R8.1 1.69,27.28 D8.A
N$12  (via drill 0.38)
  Top 0.203: D4.C v5.08,34.92
  Bottom 0.203: SJ1.2 v5.08,34.92
N$14
  Top 0.406: R2.2 16.89,28.83 15.75,27.69 S2.3
PA13  (via drill 0.38)
  Top 0.203: U3.22 47.78,33.75 48.01,33.53 48.01,31.62 v47.88,31.5
  Bottom 0.203: JP5.5 44.07,18.67 44.07,25.02 47.88,28.83 v47.88,31.5
PB22  (via drill 0.38)
  Top 0.203: U3.37 46.42,26.23 v44.96,24.77
  Bottom 0.203: v44.96,24.77 44.96,17.02 JP5.4
PB23  (via drill 0.38)
  Top 0.203: U3.38 47.28,25.05 46.86,24.64 v46.1,24.64
  Bottom 0.203: v46.1,24.64 46.1,15.62 JP5.3
RX_LED  (via drill 0.38)
  Top 0.203: U3.48 52.28,25.19 52.45,25.02 53.98,25.02 54.36,24.64 54.36,22.61 52.07,20.32 41.91,20.32 v36.58,25.65 | D8.C 6.73,27.3 v8.13,28.7
  Bottom 0.203: v8.13,28.7 8.38,28.7 13.97,34.29 19.05,34.29 20.83,36.07 26.16,36.07 v36.58,25.65
SCL
  Top 0.203: JP7.SCL 23.27,46.33 26.06,46.33 42.66,29.73 U3.32
SDA
  Top 0.203: JP7.SDA 25.27,46.86 26.29,46.86 42.92,30.23 U3.31
SOLAR_PANEL
  Top 0.61: D1.C 20.56,15.74 D2.A 19.3,12.19 20.59,10.91 JP13.2 JP12.2 20.59,2.81 JP11.2
SPI_MISO
  Top 0.203: JP7.MISO 61.82,30.43 61.67,30.58 61.67,35.87 58.34,39.19 49.61,39.19 48.56,38.15 48.56,36.02 48.28,35.73 U3.21
SPI_MOSI
  Top 0.203: U3.19 49.28,37.85 49.91,38.48 58.04,38.48 60.96,35.56 60.96,28.57 62.87,26.67 64.96,26.67 JP7.MOSI
SPI_SCK
  Top 0.203: JP7.SCK 62.79,27.89 61.32,29.36 61.32,35.71 58.19,38.84 49.76,38.84 48.92,38 48.92,35.87 48.78,35.72 U3.20
SWCLK  (via drill 0.38)
  Top 0.203: U3.45 50.78,27.54 v51.05,27.81 | JP6.4 51.31,16 51.31,12.7 50.42,11.81 44.83,11.81 JP5.2
  Bottom 0.203: v51.05,27.81 51.05,18.03 JP6.4
SWDIO  (via drill 0.38)
  Top 0.203: U3.46 51.28,27.02 51.75,27.5 51.75,28.26 v51.12,28.89 | JP6.2 51.69,16.89 51.69,12.45 49.4,10.16 JP5.1
  Bottom 0.203: JP6.2 50.16,27.94 v51.12,28.89
TX_LED  (via drill 0.38)
  Top 0.203: U3.39 47.78,24.92 46.74,23.88 40.39,23.88 v37.85,26.42 | D7.C 7.75,29.84 v7.87,29.97
  Bottom 0.203: v7.87,29.97 8.89,29.97 13.72,34.8 18.8,34.8 20.57,36.58 27.69,36.58 v37.85,26.42
USB_D+  (via drill 0.38)
  Top 0.203: U3.34 41.09,28.73 29.69,40.13 v28.19,40.13 | JP2.3 v16.76,41.15
  Bottom 0.203: v28.19,40.13 27.69,40.13 27.18,40.64 18.54,40.64 18.29,40.39 17.53,40.39 v16.76,41.15
USB_D-  (via drill 0.38)
  Top 0.203: U3.33 41.26,29.23 29.34,41.15 v27.69,41.15 | JP2.2 5.45,40.5 5.59,40.64 16.26,40.64 16.51,40.39 17.27,40.39 v18.03,41.15
  Bottom 0.203: v27.69,41.15 v18.03,41.15
USB_HOST_EN  (via drill 0.6)
  Top 0.203: U3.41 48.78,27.13 49.02,27.37 49.02,28.07 48.64,28.45 47.69,28.45 44.39,25.15 v40.89,25.15
VDDANA
  Top 0.279: U3.6 55.5,30.23 55.97,30.7 C12.1 L1.2
VDDCORE
  Top 0.254: U3.43 49.78,22.86 49.57,22.64 C14.1
VIN  (via drill 0.5, 0.6)
  Top 0.203: D5.A 2.55,23.88 14.22,23.88 v14.73,24.38
  Top 0.61: v14.73,24.38 12.7,26.42 v12.7,36.83
  Bottom 0.406: JP3.PWR 15.86,5.08 22.61,5.08 26.92,0.76 43.94,0.76 JP7.VIN
  other vias: 30.48,30.23 30.48,28.96 16.51,23.88 11.43,35.81
  pour Top (isolate 0.254, no thermals): 25.15,29.72 25.15,28.7 27.94,28.7 28.7,27.94 31.5,27.94 31.5,30.99 28.45,30.99 27.18,29.72
  pour Top (isolate 0.508, rank 2, no thermals): 0,10.16 7.11,10.16 9.65,7.62 14.22,7.62 16.26,9.65 16.26,11.68 17.53,12.95 17.53,25.15 14.22,25.15 13.72,24.64 13.72,14.48 13.21,13.97 0,13.97
  pour Bottom (no thermals): 14.22,25.65 13.72,25.15 13.72,23.88 14.48,23.11 26.67,23.11 31.5,27.94 31.5,30.99 29.72,30.99 29.72,28.96 26.42,25.65
  pour Top (isolate 0.254, rank 2): 8.89,40.39 8.89,37.34 11.18,35.05 13.21,35.05 13.72,35.56 13.72,40.39
VUSB
  pour Top (isolate 0.254, no thermals): 3.56,40.39 8.64,40.39 8.64,37.34 6.35,37.34 5.59,37.34 3.56,39.37

### Text on the board
Bottom: v10
tPlace: SCL | SDA | AREF | GND | D13 | D12 | D11 | D10 | D9 | D8 | D7 | D6 | D5 | D4 | D3 | D2 | TX/D1 | RX/D0 | ~ | ~ | ~ | ~ | ~ | ~ | ~ | ~ | ~ | ~ | Serial1 | Coringa-M0 | EH01_SOUT | EH01_SAIN | EH01_SEN | EH01_SCK | GND | Rev. 01.00 | POWER | EH01 | 13 | 3V3 | TX | MISO | SCK | MOSI | RX | CHARGE | USB_HOST_EN | !RST! | GND | BAT | 3.3V | SWDIO | Serial | GND | SWCLK | RESET | 5V | 5V | !RESET! | 38 | 30/TX | 31/RX | SWCLK | SWDIO | GND | SOLAR / PANEL | IOREF | !RESET! | 3.3V | 5V | GND | GND | VIN | A0/DAC | A1 | A2 | A3 | A4 | A5
bPlace: SCL | SDA | AREF | GND | D13 | D12 | D11 | D10 | D9 | D8 | D7 | D6 | D5 | D4 | D3 | D2 | TX/D1 | RX/D0 | ~ | ~ | ~ | ~ | ~ | ~ | ~ | ~ | ~ | ~ | PWR / LED | 3V3 | MISO | SCK | MOSI | !RST! | GND | 3.3V | SWDIO | GND | SWCLK | 5V | !RESET! | 38 | 30/TX | 31/RX | SWCLK | SWDIO | GND | IOREF | !RESET! | 3.3V | VUSB | GND | GND | VIN | A0/DAC | A1 | A2 | A3 | A4 | A5
Measures: Units in inches